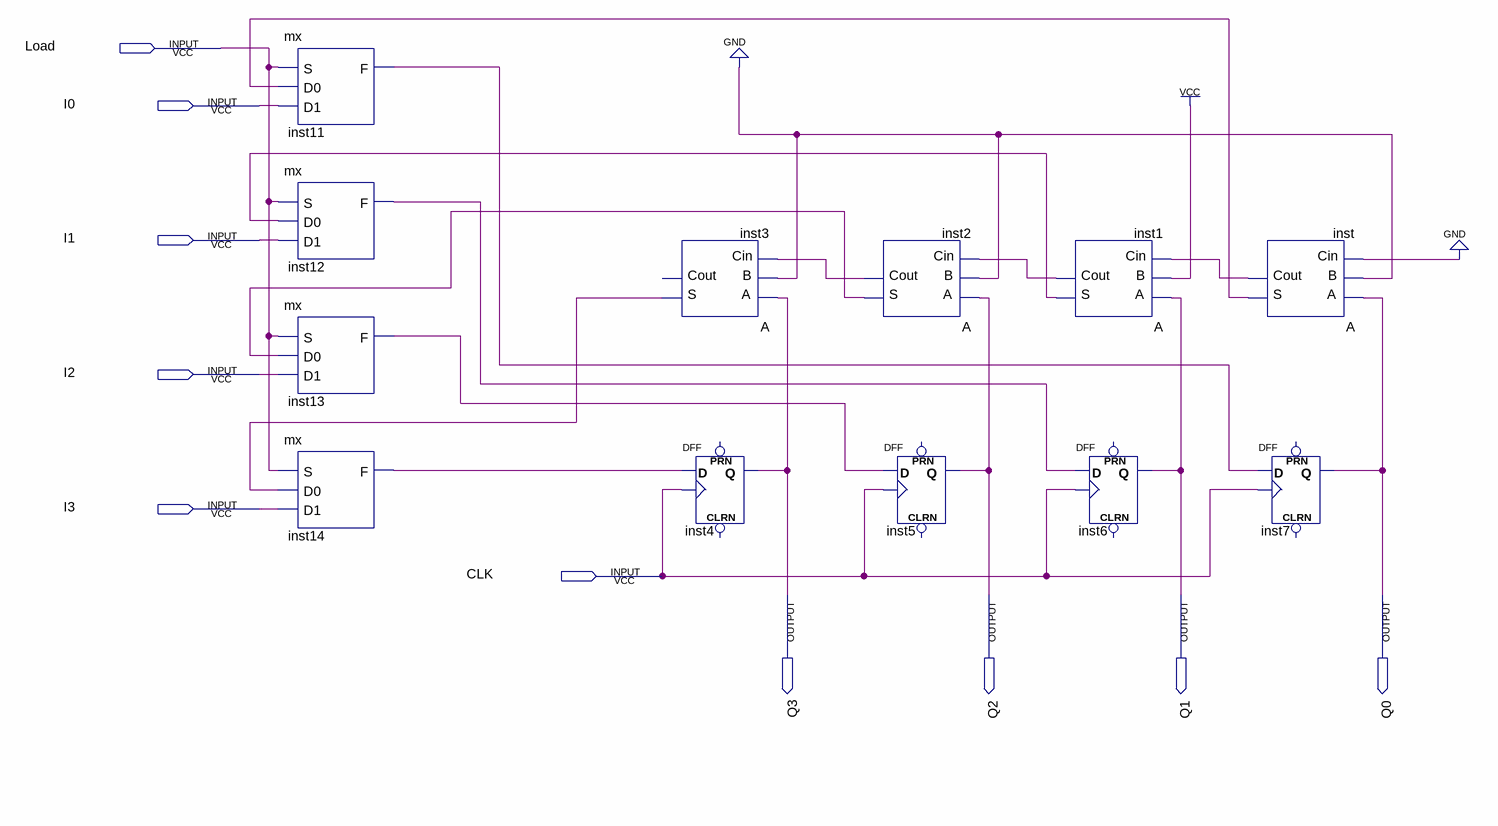
[diagram p0: schematic sheet]
// Quartus schematic Counter.bdf as structural Verilog: 12 symbols, 10 pins
module Counter (
  input  Load,
  input  I0,
  input  I1,
  input  I2,
  input  I3,
  input  CLK,
  output Q3,
  output Q2,
  output Q1,
  output Q0
);

  wire inst1_cout, inst1_s, inst2_cout, inst2_s, inst3_s, inst11_f, inst12_f, inst13_f, inst14_f, inst_cout,
       inst_s;

  mx inst11 (.S(Load), .D0(inst_s), .D1(I0), .F(inst11_f));
  mx inst12 (.S(Load), .D0(inst1_s), .D1(I1), .F(inst12_f));
  mx inst13 (.S(Load), .D0(inst2_s), .D1(I2), .F(inst13_f));
  mx inst14 (.S(Load), .D0(inst3_s), .D1(I3), .F(inst14_f));
  A inst3 (.A(Q3), .B(1'b0), .Cin(inst2_cout), .S(inst3_s));  // open: Cout
  DFF inst4 (.CLK(CLK), .D(inst14_f), .Q(Q3));  // open: CLRN, PRN
  A inst2 (.A(Q2), .B(1'b0), .Cin(inst1_cout), .S(inst2_s), .Cout(inst2_cout));
  DFF inst5 (.CLK(CLK), .D(inst13_f), .Q(Q2));  // open: CLRN, PRN
  A inst1 (.A(Q1), .B(1'b1), .Cin(inst_cout), .S(inst1_s), .Cout(inst1_cout));
  DFF inst6 (.CLK(CLK), .D(inst12_f), .Q(Q1));  // open: CLRN, PRN
  A inst (.A(Q0), .B(1'b0), .Cin(1'b0), .S(inst_s), .Cout(inst_cout));
  DFF inst7 (.CLK(CLK), .D(inst11_f), .Q(Q0));  // open: CLRN, PRN
endmodule
